# EAGLE design MAESTRAL (EAGLE 7.3.0)

## Sheet 1 of 8: PROCESSOR
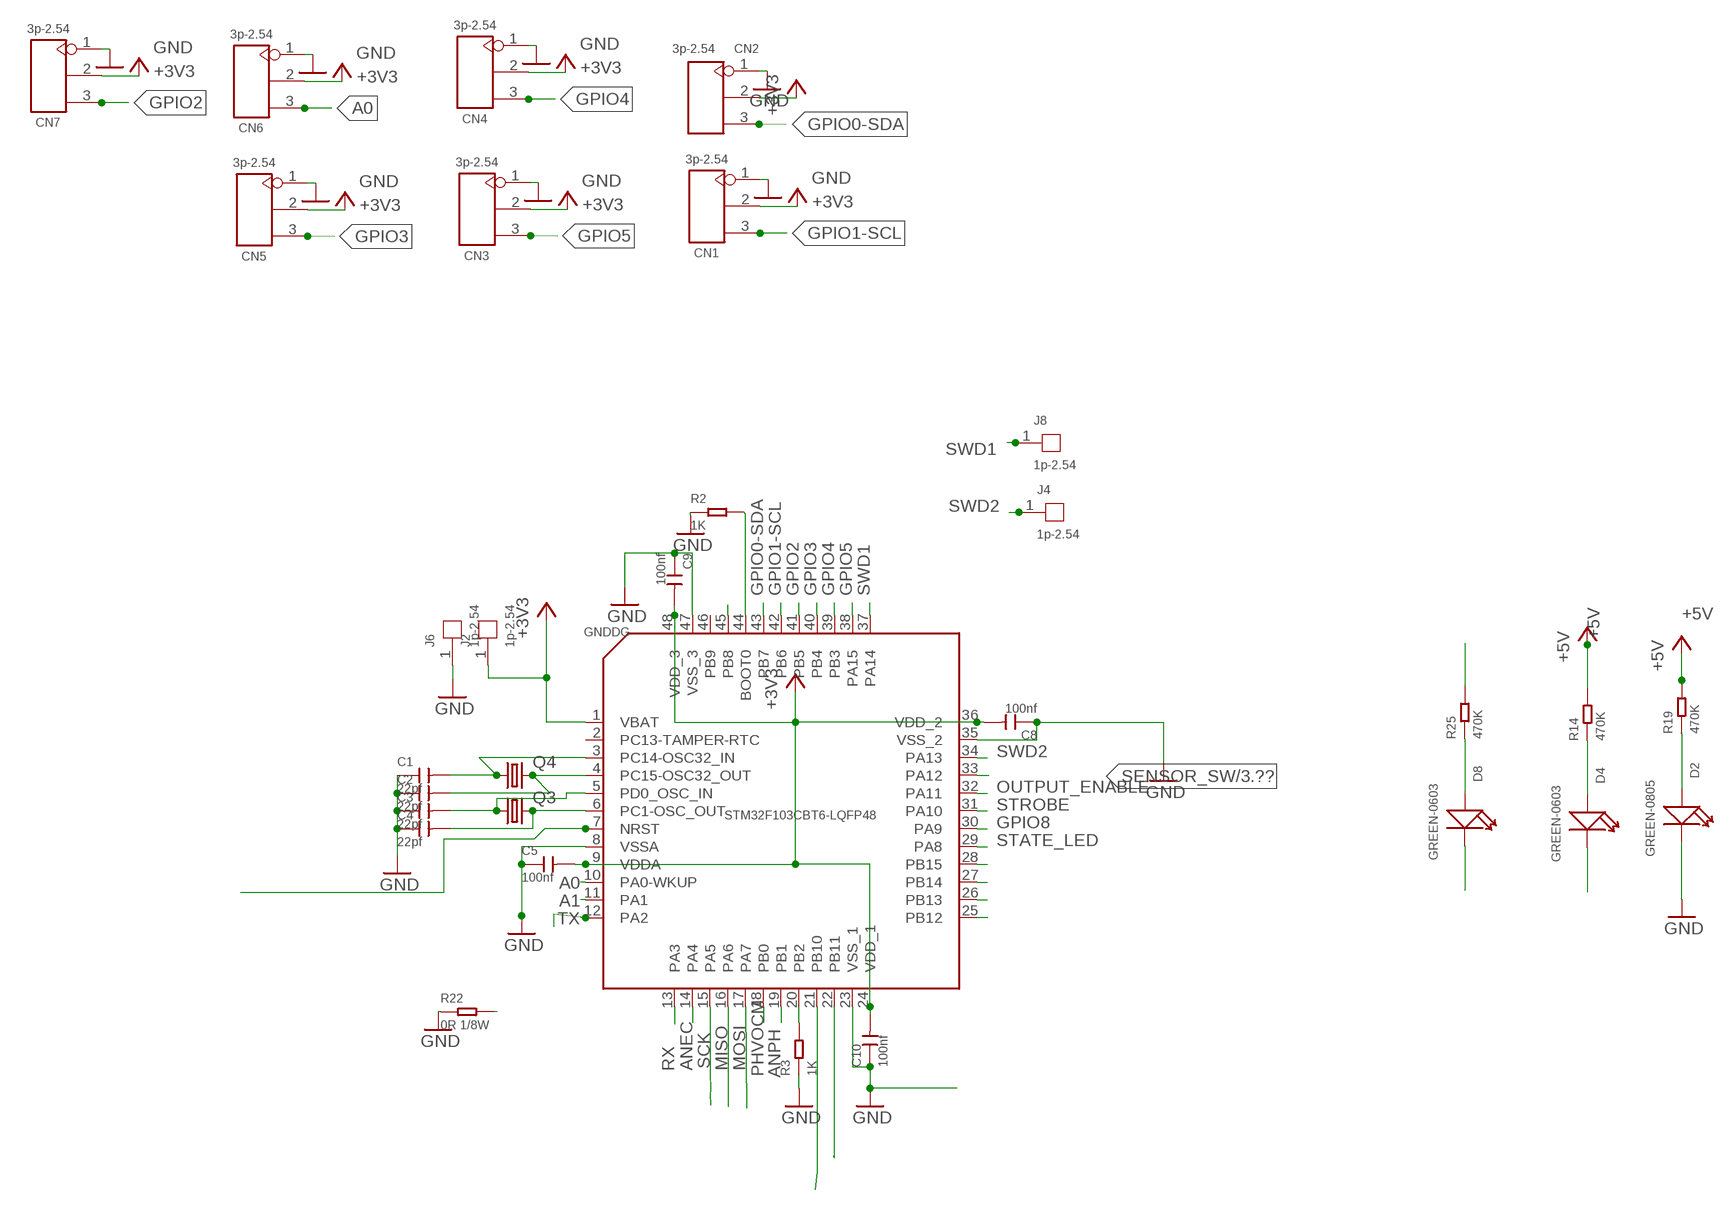
[diagram p0: schematic, sheet 1]

### Parts
C1  22pf  CERAMIC-22PF-50V-5%-NPO(0603)  [C0603]
C2  22pf  CERAMIC-22PF-50V-5%-NPO(0603)  [C0603]
C3  22pf  CERAMIC-22PF-50V-5%-NPO(0603)  [C0603]
C4  22pf  CERAMIC-22PF-50V-5%-NPO(0603)  [C0603]
C5  100nf  CERAMIC-100NF-50V-10%-X7R(0603)  [C0603]
C8  100nf  CERAMIC-100NF-50V-10%-X7R(0603)  [C0603]
C9  100nf  CERAMIC-100NF-50V-10%-X7R(0603)  [C0603]
C10  100nf  CERAMIC-100NF-50V-10%-X7R(0603)  [C0603]
CN1  3p-2.54  DIP-BLACK-MALE-HEADER-VERT(3P-2.54)  [H3-2.54]
CN2  3p-2.54  DIP-BLACK-MALE-HEADER-VERT(3P-2.54)  [H3-2.54]
CN3  3p-2.54  DIP-BLACK-MALE-HEADER-VERT(3P-2.54)  [H3-2.54]
CN4  3p-2.54  DIP-BLACK-MALE-HEADER-VERT(3P-2.54)  [H3-2.54]
CN5  3p-2.54  DIP-BLACK-MALE-HEADER-VERT(3P-2.54)  [H3-2.54]
CN6  3p-2.54  DIP-BLACK-MALE-HEADER-VERT(3P-2.54)  [H3-2.54]
CN7  3p-2.54  DIP-BLACK-MALE-HEADER-VERT(3P-2.54)  [H3-2.54]
D2  GREEN-0805  SMD-LED-CLEAR-GREEN(0805)  [LED-0805]
D4  GREEN-0603  SMD-LED-CLEAR-GREEN(0603)  [LED-0603]
D8  GREEN-0603  SMD-LED-CLEAR-GREEN(0603)  [LED-0603]
GNDDG  STM32F103CBT6-LQFP48  MCU-STM32F103CBT6(LQFP48)  [LQFP48-0.5-7X7MM]
J2  1p-2.54  DIP-BLACK-ROUND-FEMALE-HEADER-VERT(1P-2.54)  [1P-65/35MIL]
J4  1p-2.54  DIP-BLACK-ROUND-FEMALE-HEADER-VERT(1P-2.54)  [1P-65/35MIL]
J6  1p-2.54  DIP-BLACK-ROUND-FEMALE-HEADER-VERT(1P-2.54)  [1P-65/35MIL]
J8  1p-2.54  DIP-BLACK-ROUND-FEMALE-HEADER-VERT(1P-2.54)  [1P-65/35MIL]
Q3  CRYSTALSM49  [SM49]
Q4  CRYSTALMM20SS  [MM20SS]
R2  1K  SMD-RES-1K-1%-1/10W(0603)  [R0603]
R3  1K  SMD-RES-1K-1%-1/10W(0603)  [R0603]
R14  470K  SMD-RES-12K-1%-1/10W(0603)  [R0603]
R19  470K  SMD-RES-12K-1%-1/10W(0603)  [R0603]
R22  0R 1/8W  SMD-RES-0R-5%-1/8W(0805)  [R0805]
R25  470K  SMD-RES-12K-1%-1/10W(0603)  [R0603]

### Nets
+3V3: C5.2 C8.2 C9.2 C10.2 CN1.2 CN2.2 CN3.2 CN4.2 CN5.2 CN6.2 CN7.2 GNDDG.1(VBAT) GNDDG.9(VDDA) GNDDG.24(VDD_1) GNDDG.36(VDD_2) GNDDG.48(VDD_3) J2.1 ; also sheet 2,3,4,6,8
+5V: R14.2 R19.2 ; also sheet 3,5,7
A0: CN6.3 GNDDG.10(PA0-WKUP)
A1: GNDDG.11(PA1) ; also sheet 7
ANEC: GNDDG.14(PA4) ; also sheet 5
ANPH: GNDDG.19(PB1) ; also sheet 4
ECGND: D4.- ; also sheet 3,5
GND: CN1.1 CN2.1 CN3.1 CN4.1 CN5.1 CN6.1 CN7.1 D2.- R22.1 ; also sheet 3,6,7
GNDDG: C1.1 C2.1 C3.1 C4.1 C5.1 C8.1 C9.1 C10.1 D8.- GNDDG.8(VSSA) GNDDG.23(VSS_1) GNDDG.35(VSS_2) GNDDG.47(VSS_3) J6.1 R2.1 R3.1 R22.2 ; supply symbol labelled GND ; also sheet 4,6,8
GPIO0-SDA: CN2.3 GNDDG.43(PB7)
GPIO1-SCL: CN1.3 GNDDG.42(PB6)
GPIO2: CN7.3 GNDDG.41(PB5)
GPIO3: CN5.3 GNDDG.40(PB4)
GPIO4: CN4.3 GNDDG.39(PB3)
GPIO5: CN3.3 GNDDG.38(PA15)
GPIO8: GNDDG.30(PA9)
MISO: GNDDG.16(PA6) ; also sheet 2
MISO-SDO: GNDDG.27(PB14) ; also sheet 4
MOSI: GNDDG.17(PA7) ; also sheet 2
MOSI-SDI: GNDDG.28(PB15) ; also sheet 4
N$1: C2.2 GNDDG.4(PC15-OSC32_OUT) Q4.4
N$2: C1.2 GNDDG.3(PC14-OSC32_IN) Q4.1
N$3: C4.2 GNDDG.6(PC1-OSC_OUT) Q3.2
N$4: C3.2 GNDDG.5(PD0_OSC_IN) Q3.1
N$5: GNDDG.7(NRST) ; also sheet 6
N$8: GNDDG.20(PB2) R3.2
N$17: GNDDG.44(BOOT0) R2.2
N$19: D8.+ R25.1
N$37: GNDDG.45(PB8) R25.2
N$38: D4.+ R14.1
N$46: D2.+ R19.1
OUTPUT_ENABLE: GNDDG.32(PA11) ; also sheet 2
PHCS: GNDDG.25(PB12) ; also sheet 4
PHVOCM: GNDDG.18(PB0) ; also sheet 4
RX: GNDDG.13(PA3) ; also sheet 6
SCK: GNDDG.15(PA5) ; also sheet 2
SCL2: GNDDG.21(PB10) ; also sheet 8
SCLK: GNDDG.26(PB13) ; also sheet 4
SDA2: GNDDG.22(PB11) ; also sheet 8
SENSOR_SW: GNDDG.33(PA12) ; also sheet 3
STATE_LED: GNDDG.29(PA8)
STROBE: GNDDG.31(PA10) ; also sheet 2
SWD1: GNDDG.37(PA14) J8.1
SWD2: GNDDG.34(PA13) J4.1
TX: GNDDG.12(PA2) ; also sheet 6
Unconnected: GNDDG.2(PC13-TAMPER-RTC) GNDDG.46(PB9)

## Sheet 2 of 8: MIC5841
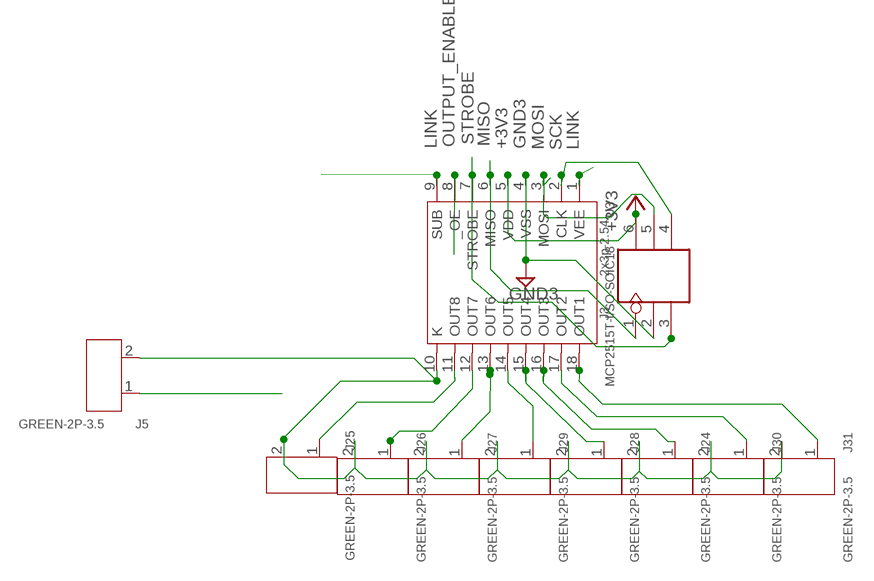
[diagram p1: schematic, sheet 2]

### Parts
J3  2x3p-2.54  DIP-BLACK-FEMALE-HEADER-VERT(2X3P-2.54)  [H2X3-2.54]
J5  GREEN-2P-3.5  SCREW-TERMINAL-GREEN(2P-3.5)  [H2-3.5-7.0X7.0MM]
J24  GREEN-2P-3.5  SCREW-TERMINAL-GREEN(2P-3.5)  [H2-3.5-7.0X7.0MM]
J25  GREEN-2P-3.5  SCREW-TERMINAL-GREEN(2P-3.5)  [H2-3.5-7.0X7.0MM]
J26  GREEN-2P-3.5  SCREW-TERMINAL-GREEN(2P-3.5)  [H2-3.5-7.0X7.0MM]
J27  GREEN-2P-3.5  SCREW-TERMINAL-GREEN(2P-3.5)  [H2-3.5-7.0X7.0MM]
J28  GREEN-2P-3.5  SCREW-TERMINAL-GREEN(2P-3.5)  [H2-3.5-7.0X7.0MM]
J29  GREEN-2P-3.5  SCREW-TERMINAL-GREEN(2P-3.5)  [H2-3.5-7.0X7.0MM]
J30  GREEN-2P-3.5  SCREW-TERMINAL-GREEN(2P-3.5)  [H2-3.5-7.0X7.0MM]
J31  GREEN-2P-3.5  SCREW-TERMINAL-GREEN(2P-3.5)  [H2-3.5-7.0X7.0MM]
U3  MCP2515T-I/SO-SOIC18  INTERFACE-MCP2515T-I/SO(SOIC18)  [SOIC18-1.27-11.5X7.5MM]

### Nets
+3V3: J3.6 U3.5(VDD) ; also sheet 1,3,4,6,8
GND3: J3.2 U3.4(VSS)
LINK: J5.1 U3.1(VEE) U3.9(SUB)
MISO: J3.1 U3.6(MISO) ; also sheet 1
MOSI: J3.5 U3.3(MOSI) ; also sheet 1
N$20: J26.1 U3.12(OUT7)
N$21: J27.1 U3.13(OUT6)
N$24: J5.2 J24.2 J25.2 J26.2 J27.2 J28.2 J29.2 J30.2 J31.2 U3.10(K)
N$26: J29.1 U3.14(OUT5)
N$27: J28.1 U3.15(OUT4)
N$28: J24.1 U3.16(OUT3)
N$45: J30.1 U3.17(OUT2)
N$68: J25.1 U3.11(OUT8)
OUT1: J31.1 U3.18(OUT1)
OUTPUT_ENABLE: U3.8(_OE) ; also sheet 1
SCK: J3.4 U3.2(CLK) ; also sheet 1
STROBE: J3.3 U3.7(STROBE) ; also sheet 1

## Sheet 3 of 8: POWER SUPPLY
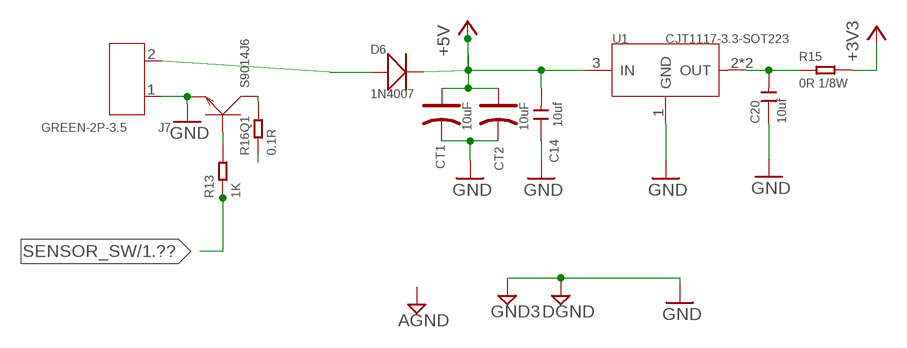
[diagram p2: schematic, sheet 3]

### Parts
C14  10uf  CERAMIC-10UF-25V-10%-X5R(0805)  [C0805]
C20  10uf  CERAMIC-10UF-25V-10%-X5R(0805)  [C0805]
CT1  10uF  ALUMINUM-SMD-220UF-16V(D6.3-H7.7MM)  [ELECTRO-SMD-C-6MM]
CT2  10uF  ALUMINUM-SMD-220UF-16V(D6.3-H7.7MM)  [ELECTRO-SMD-C-6MM]
D6  1N4007  DIODE-GEN-PURPOSE-1KV-1A(DO-214AC)  [DO-214AC]
J7  GREEN-2P-3.5  SCREW-TERMINAL-GREEN(2P-3.5)  [H2-3.5-7.0X7.0MM]
Q1  S9014J6  SMD-TRANSISTOR-NPN-50V-100MA-S9014J6(SOT-23)  [SOT-23]
R13  1K  SMD-RES-1K-1%-1/10W(0603)  [R0603]
R15  0R 1/8W  SMD-RES-0R-5%-1/8W(0805)  [R0805]
R16  0.1R  SMD-RES-0.1R-5%-1/8W(0805)  [R0805]
U1  CJT1117-3.3-SOT223  PMIC-CJT1117-3.3(SOT223)  [SOT-223]

### Nets
+3V3: R15.2 ; also sheet 1,2,4,6,8
+5V: C14.2 CT1.+ CT2.+ D6.2(-) U1.3(IN) ; also sheet 1,5,7
ECGND: R16.1 ; also sheet 1,5
GND: C14.1 C20.1 CT1.- CT2.- J7.1 Q1.2(E) U1.1(GND) ; also sheet 1,6,7
INTERRUMPIDO: Q1.3(C) R16.2
N$9: D6.1(+) J7.2
N$29: C20.2 R15.1 U1.2(OUT) U1.TER(OUT)
R: Q1.1(B) R13.2
SENSOR_SW: R13.1 ; also sheet 1

## Sheet 4 of 8: PH SENSOR
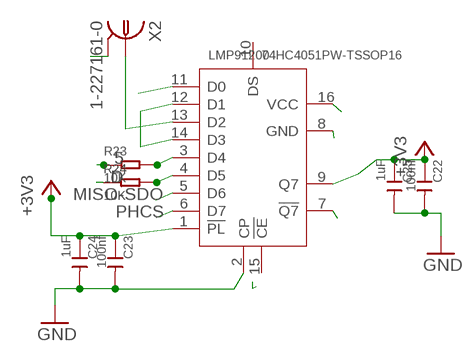
[diagram p3: schematic, sheet 4]

### Parts
C22  100nf  CERAMIC-100NF-50V-10%-X7R(0603)  [C0603]
C23  100nf  CERAMIC-100NF-50V-10%-X7R(0603)  [C0603]
C24  1uF  CERAMIC-100NF-50V-10%-X7R(0603)  [C0603]
C25  1uF  CERAMIC-100NF-50V-10%-X7R(0603)  [C0603]
LMP91200  74HC4051PW-TSSOP16  LOGIC-74HC4051PW(TSSOP16)  [TSSOP16-0.65-5X4.4MM]
R23  10K  SMD-RES-10K-1%-1/10W(0603)  [R0603]
R24  10K  SMD-RES-10K-1%-1/10W(0603)  [R0603]
X2  1-227161-0  [AMP_227161]

### Nets
5: LMP91200.3(D4) R23.2
+3V3: C22.1 C23.1 C24.1 C25.1 LMP91200.1(!PL) LMP91200.9(Q7) ; also sheet 1,2,3,6,8
ANPH: R24.1 ; also sheet 1
D: LMP91200.4(D5) R24.2
GNDDG: C22.2 C23.2 C24.2 C25.2 LMP91200.2(CP) ; supply symbol labelled GND ; also sheet 1,6,8
MISO-SDO: LMP91200.5(D6) ; also sheet 1
MOSI-SDI: LMP91200.8(GND) ; also sheet 1
N$41: LMP91200.11(D0)
N$42: LMP91200.12(D1) LMP91200.14(D3)
N$43: LMP91200.13(D2) X2.1
PHCS: LMP91200.6(D7) ; also sheet 1
PHVOCM: R23.1 ; also sheet 1
SCLK: LMP91200.7(!Q7) ; also sheet 1
VCM: LMP91200.16(VCC) X2.2
Unconnected: LMP91200.10(DS) LMP91200.15(!CE)

## Sheet 5 of 8: EC SENSOR
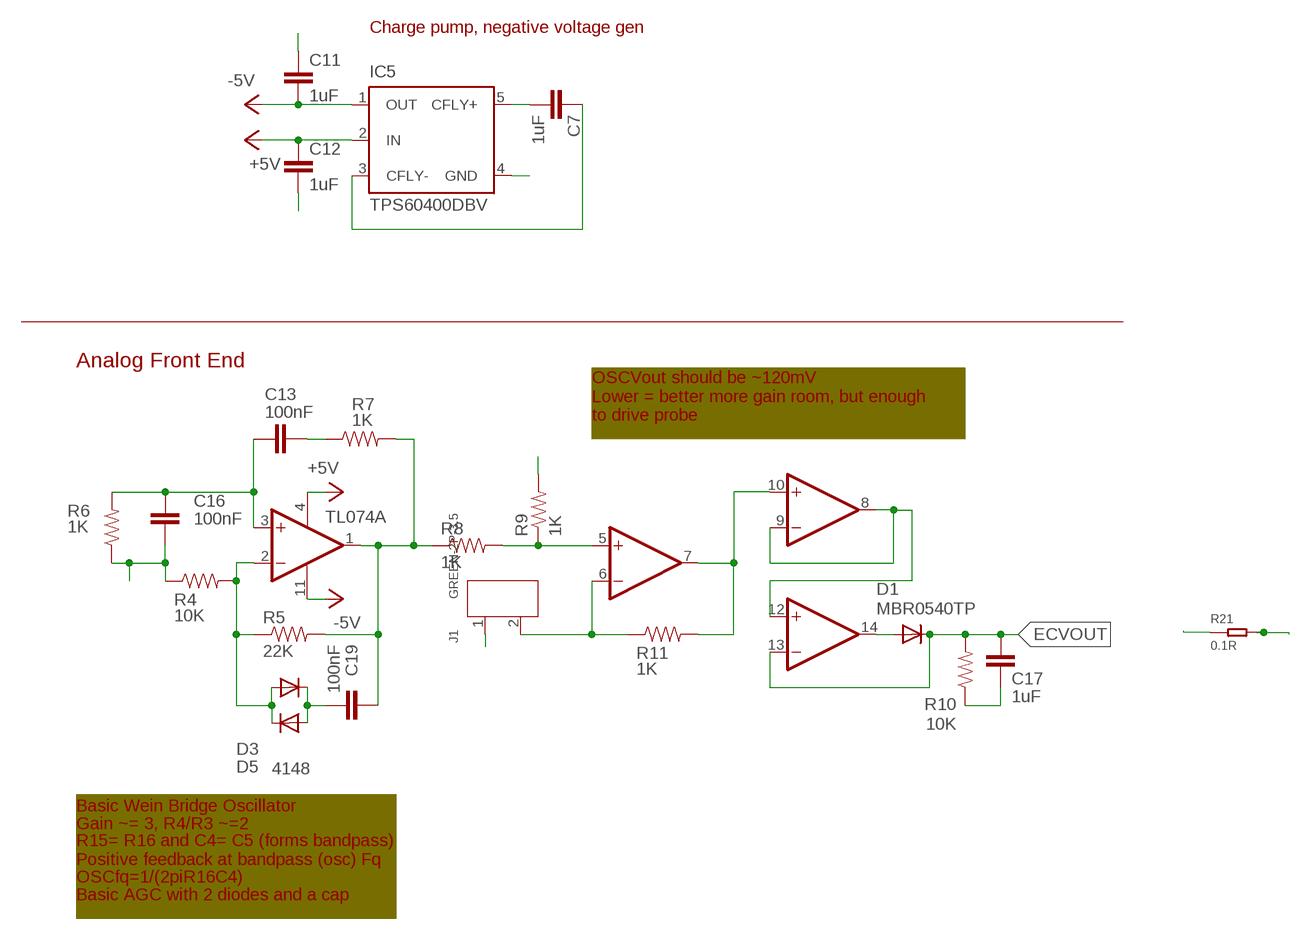
[diagram p4: schematic, sheet 5]

### Parts
C7  1uF  CAP0805  [0805]
C11  1uF  CAP0805  [0805]
C12  1uF  CAP0805  [0805]
C13  100nF  CAP0805  [0805]
C16  100nF  CAP0805  [0805]
C17  1uF  CAP0805  [0805]
C19  100nF  CAP0805  [0805]
D1  MBR0540TP  MBR0520LT  [SOD123]
D3  4148  MBR0520LT  [SOD123]
D5  4148  MBR0520LT  [SOD123]
IC5  TPS60400DBV  [SOT23-DBV]
J1  GREEN-2P-3.5  SCREW-TERMINAL-GREEN(2P-3.5)  [H2-3.5-7.0X7.0MM]
R4  10K  RESISTOR0805-RES  [0805]
R5  22K  RESISTOR0805-RES  [0805]
R6  1K  RESISTOR0805-RES  [0805]
R7  1K  RESISTOR0805-RES  [0805]
R8  1K  RESISTOR0805-RES  [0805]
R9  1K  RESISTOR0805-RES  [0805]
R10  10K  RESISTOR0805-RES  [0805]
R11  1K  RESISTOR0805-RES  [0805]
R21  0.1R  SMD-RES-0.1R-5%-1/8W(0805)  [R0805]
TL074  TL074  QUADOPAMPM  [SO14]

### Nets
+5V: C12.1 IC5.2(IN) TL074.4(P:V+) ; also sheet 1,3,7
-5V: C11.2 IC5.1(OUT) TL074.11(P:V-)
ANEC: R21.2 ; also sheet 1
ECGND: C11.1 C12.2 C16.1 C17.1 IC5.4(GND) J1.1 R4.1 R6.1 R9.2 R10.1 ; also sheet 1,3
ECVOUT: C17.2 D1.C R10.2 R21.1 TL074.13(D:-IN)
N$6: R11.2 TL074.7(B:OUT) TL074.10(C:+IN)
N$7: D1.A TL074.14(D:OUT)
N$18: C19.2 D3.C D5.A
N$22: C7.1 IC5.3(CFLY-)
N$23: C7.2 IC5.5(CFLY+)
N$30: C13.2 C16.2 R6.2 TL074.3(A:+IN)
N$31: D3.A D5.C R4.2 R5.1 TL074.2(A:-IN)
N$32: C13.1 R7.1
N$33: C19.1 R5.2 R7.2 R8.1 TL074.1(A:OUT)
N$34: R8.2 R9.1 TL074.5(B:+IN)
N$35: J1.2 R11.1 TL074.6(B:-IN)
N$39: TL074.8(C:OUT) TL074.9(C:-IN) TL074.12(D:+IN)

### Notes on the sheet
- Charge pump, negative voltage gen
- Analog Front End
- OSCVout should be ~120mV
  Lower = better more gain room, but enough
  to drive probe
- Basic Wein Bridge Oscillator
- Gain ~= 3, R4/R3 ~=2
- R15= R16 and C4= C5 (forms bandpass)
  Positive feedback at bandpass (osc) Fq
- OSCfq=1/(2piR16C4)
- Basic AGC with 2 diodes and a cap

## Sheet 6 of 8: ESP02 WIFI
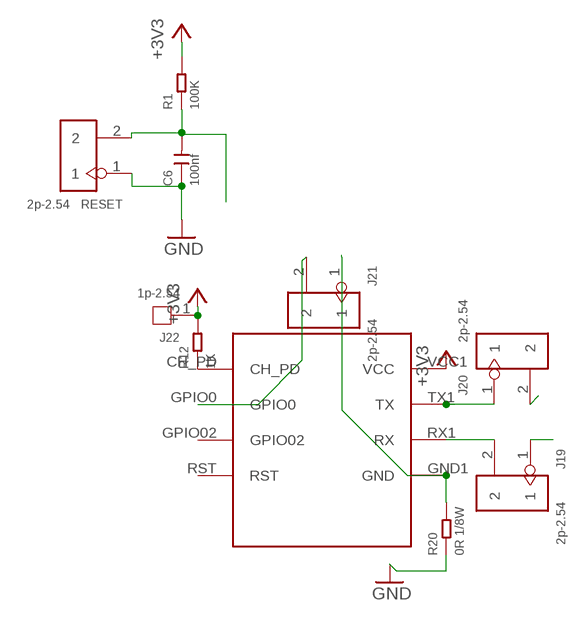
[diagram p5: schematic, sheet 6]

### Parts
C6  100nf  CERAMIC-100NF-50V-10%-X7R(0603)  [C0603]
J19  2p-2.54  DIP-BLACK-MALE-HEADER-VERT(2P-2.54)  [H2-2.54]
J20  2p-2.54  DIP-BLACK-MALE-HEADER-VERT(2P-2.54)  [H2-2.54]
J21  2p-2.54  DIP-BLACK-MALE-HEADER-VERT(2P-2.54)  [H2-2.54]
J22  1p-2.54  DIP-BLACK-ROUND-FEMALE-HEADER-VERT(1P-2.54)  [1P-65/35MIL]
R1  100K  SMD-RES-100K-1%-1/10W(0603)  [R0603]
R12  1K  SMD-RES-1K-1%-1/10W(0603)  [R0603]
R20  0R 1/8W  SMD-RES-0R-5%-1/8W(0805)  [R0805]
RESET  2p-2.54  DIP-BLACK-MALE-HEADER-VERT(2P-2.54)  [H2-2.54]
U$1  ESP-03  [ESP]

### Nets
+3V3: J22.1 R1.2 R12.2 U$1.VCC1(VCC) ; also sheet 1,2,3,4,8
GND: R20.1 ; also sheet 1,3,7
GNDDG: C6.1 RESET.1 ; supply symbol labelled GND ; also sheet 1,4,8
N$5: C6.2 R1.1 RESET.2 ; also sheet 1
N$25: R12.1 U$1.CH_PD
N$51: J21.1 R20.2 U$1.GND1(GND)
N$55: J20.1 U$1.TX1(TX)
N$56: J19.2 U$1.RX1(RX)
N$59: J21.2 U$1.GPIO0
RX: J19.1 ; also sheet 1
TX: J20.2 ; also sheet 1
Unconnected: U$1.GPIO02 U$1.RST

## Sheet 7 of 8: Amperimeter
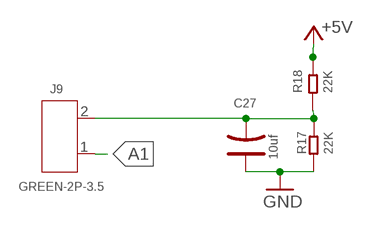
[diagram p6: schematic, sheet 7]

### Parts
C27  10uf  TANTALUM-SMD-10UF-10V-10%(AVX-A)  [AVX-A]
J9  GREEN-2P-3.5  SCREW-TERMINAL-GREEN(2P-3.5)  [H2-3.5-7.0X7.0MM]
R17  22K  SMD-RES-10K-1%-1/10W(0603)  [R0603]
R18  22K  SMD-RES-10K-1%-1/10W(0603)  [R0603]

### Nets
+5V: R18.2 ; also sheet 1,3,5
A1: J9.1 ; also sheet 1
GND: C27.+ R17.1 ; also sheet 1,3,6
N$72: C27.- J9.2 R17.2 R18.1

## Sheet 8 of 8: FRAM
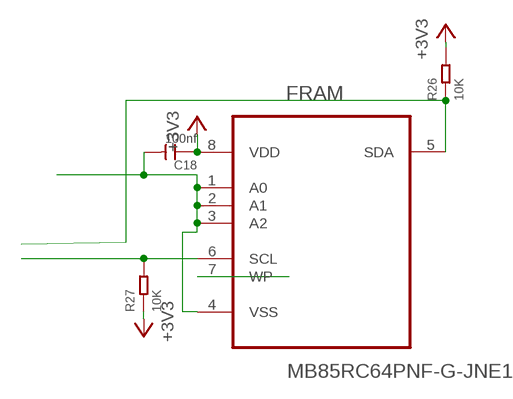
[diagram p7: schematic, sheet 8]

### Parts
C18  100nf  CERAMIC-100NF-50V-10%-X7R(0603)  [C0603]
FRAM  MB85RC64PNF-G-JNE1  [SOIC127P600X175-8N]
R26  10K  SMD-RES-10K-1%-1/10W(0603)  [R0603]
R27  10K  SMD-RES-10K-1%-1/10W(0603)  [R0603]

### Nets
+3V3: C18.1 FRAM.7(WP) FRAM.8(VDD) R26.2 R27.1 ; also sheet 1,2,3,4,6
GNDDG: C18.2 FRAM.1(A0) FRAM.2(A1) FRAM.3(A2) FRAM.4(VSS) ; also sheet 1,4,6
SCL2: FRAM.6(SCL) R27.2 ; also sheet 1
SDA2: FRAM.5(SDA) R26.1 ; also sheet 1

## Library data of the parts
C1-C4 = Seeed-OPL-Capacitor:CERAMIC-22PF-50V-5%-NPO(0603): 302010143
C5 C6 C8-C10 C18 C22 C23 = Seeed-OPL-Capacitor:CERAMIC-100NF-50V-10%-X7R(0603): 302010138; MPN: CC0603KRX7R9BB104
C7 C11-C13 C16 C17 C19 = SparkysWidgets:CAP: Capacitor Standard 0603 ceramic capacitor, and 0.1" leaded capacitor.
C14 C20 = Seeed-OPL-Capacitor:CERAMIC-10UF-25V-10%-X5R(0805): 302010178; MPN: CC0805KKX5R8BB106
C24 C25 = Seeed-OPL-Capacitor:CERAMIC-100NF-50V-10%-X7R(0603): 302010138; MPN: CC0603KRX7R9BB104; VALUE: 100nf
C27 = Seeed-Capacitor-2016:TANTALUM-SMD-10UF-10V-10%(AVX-A): 302020011; MPN: TAJA106K010RNJ
CN1-CN7 = Seeed-Connector -2016:DIP-BLACK-MALE-HEADER-VERT(3P-2.54): 320020079
CT1 CT2 = Seeed-OPL-Capacitor:ALUMINUM-SMD-220UF-16V(D6.3-H7.7MM): 302030053; MPN: CS1E221M-CRE77; VALUE: 220UF
D1 D3 D5 = SparkysWidgets:MBR0520LT: SCHOTTKY BARRIER RECTIFIER Source: http://onsemi.com .. MBR0520LT1-D.pdf
D2 = Seeed-OPL-Diode:SMD-LED-CLEAR-GREEN(0805): 304090057; MPN: 17-215SYGC/S530-E2/TR8
D4 D8 = Seeed-OPL-Diode:SMD-LED-CLEAR-GREEN(0603): 304090043; MPN: 19-217-G7C-AN1P2-3T
D6 = Seeed-Diode-2016:DIODE-GEN-PURPOSE-1KV-1A(DO-214AC): 304010013; MPN: 1N4007
FRAM = Fujitsu_By_element14_Batch_1:MB85RC64PNF-G-JNE1: Memory FRAM; MPN: MB85RC64PNF-G-JNE1; OC_FARNELL: 1831994; OC_NEWARK: 93R5162; PACKAGE: SO-8; SUPPLIER: FUJITSU
GNDDG = Seeed-OPL-ic:MCU-STM32F103CBT6(LQFP48): 310010004; MPN: STM32F103CBT6
IC5 = SparkysWidgets:TPS60400DBV: UNREGULATED CHARGE PUMP VOLTAGE INVERTER 60-mA unregultated charge pump voltage inverter Source: http://focus.ti.com/lit/ds/symlink/tps6040i.pdf
J1 J5 J7 J9 J24-J31 = Seeed-OPL-Connector:SCREW-TERMINAL-GREEN(2P-3.5): 320110028
J2 J4 J6 J8 J22 = Seeed-OPL-Connector:DIP-BLACK-ROUND-FEMALE-HEADER-VERT(1P-2.54): 320030026; MPN: RF130-1013BBS0741
J3 = Seeed-OPL-Connector:DIP-BLACK-FEMALE-HEADER-VERT(2X3P-2.54): 320030011; MPN: F185-1203A1BSYA1
J19-J21 RESET = Seeed-OPL-Connector:DIP-BLACK-MALE-HEADER-VERT(2P-2.54): 320020016; MPN: P125-1102A0BS116A1
LMP91200 = Seeed-OPL-ic:LOGIC-74HC4051PW(TSSOP16): 310070017; MPN: 74HC4051PW
Q1 = Seeed-OPL-Transistor:SMD-TRANSISTOR-NPN-50V-100MA-S9014J6(SOT-23): 305010022; MPN: S9014J6
Q3 Q4 = crystal:CRYSTAL: CRYSTAL; OC_FARNELL: unknown; OC_NEWARK: unknown
R1 = Seeed-OPL-Resistor:SMD-RES-100K-1%-1/10W(0603): 301010196; MPN: RC0603FR-07100KL
R2 R3 R12 R13 = Seeed-OPL-Resistor:SMD-RES-1K-1%-1/10W(0603): 301010298; MPN: RC0603FR-071KL
R4-R11 = SparkysWidgets:RESISTOR: Resistor Basic schematic elements and footprints for 0603, 1206, and PTH resistors.
R14 R19 R25 = Seeed-OPL-Resistor:SMD-RES-12K-1%-1/10W(0603): 301010102; MPN: RC0603FR-0712KL; VALUE: 12K
R15 R20 R22 = Seeed-OPL-Resistor:SMD-RES-0R-5%-1/8W(0805): 301010359; MPN: RC0805JR-070RL
R16 R21 = Seeed-OPL-Resistor:SMD-RES-0.1R-5%-1/8W(0805): 301010264; MPN: RL0805JR-070R1L
R17 R18 = Seeed-Resistor-2016:SMD-RES-10K-1%-1/10W(0603): 301010299; MPN: RC0603FR-0710KL; VALUE: 10K
R23 R24 = Seeed-Resistor-2016:SMD-RES-10K-1%-1/10W(0603): 301010299; MPN: RC0603FR-0710KL
R26 R27 = Seeed-OPL-Resistor:SMD-RES-10K-1%-1/10W(0603): 301010299; MPN: RC0603FR-0710KL
TL074 = SW_DigitalAnalogICs:QUADOPAMP: Quad General Purpose, Low Voltage, Rail-to-Rail Output Operational Amplifiers Source: http://www.national.com/mpf/LM/LMV321.html http://www.national.com/dt/lmv_qual.pdf
U1 = Seeed-OPL-ic:PMIC-CJT1117-3.3(SOT223): 310030097; MPN: CJT1117-3.3
U3 = Seeed-OPL-ic:INTERFACE-MCP2515T-I/SO(SOIC18): 310070025; MPN: MCP2515T-I/SO
U$1 = esp-03:ESP-03
X2 = con-coax:?227161*: JACK, RIGHT ANGLE, 50 OHM, PCB, BNC Source: amp_227161.pdf; MF: TYCO ELECTRONICS; MPN: 1-227161; OC_FARNELL: unknown; OC_NEWARK: 33B3200

## Board
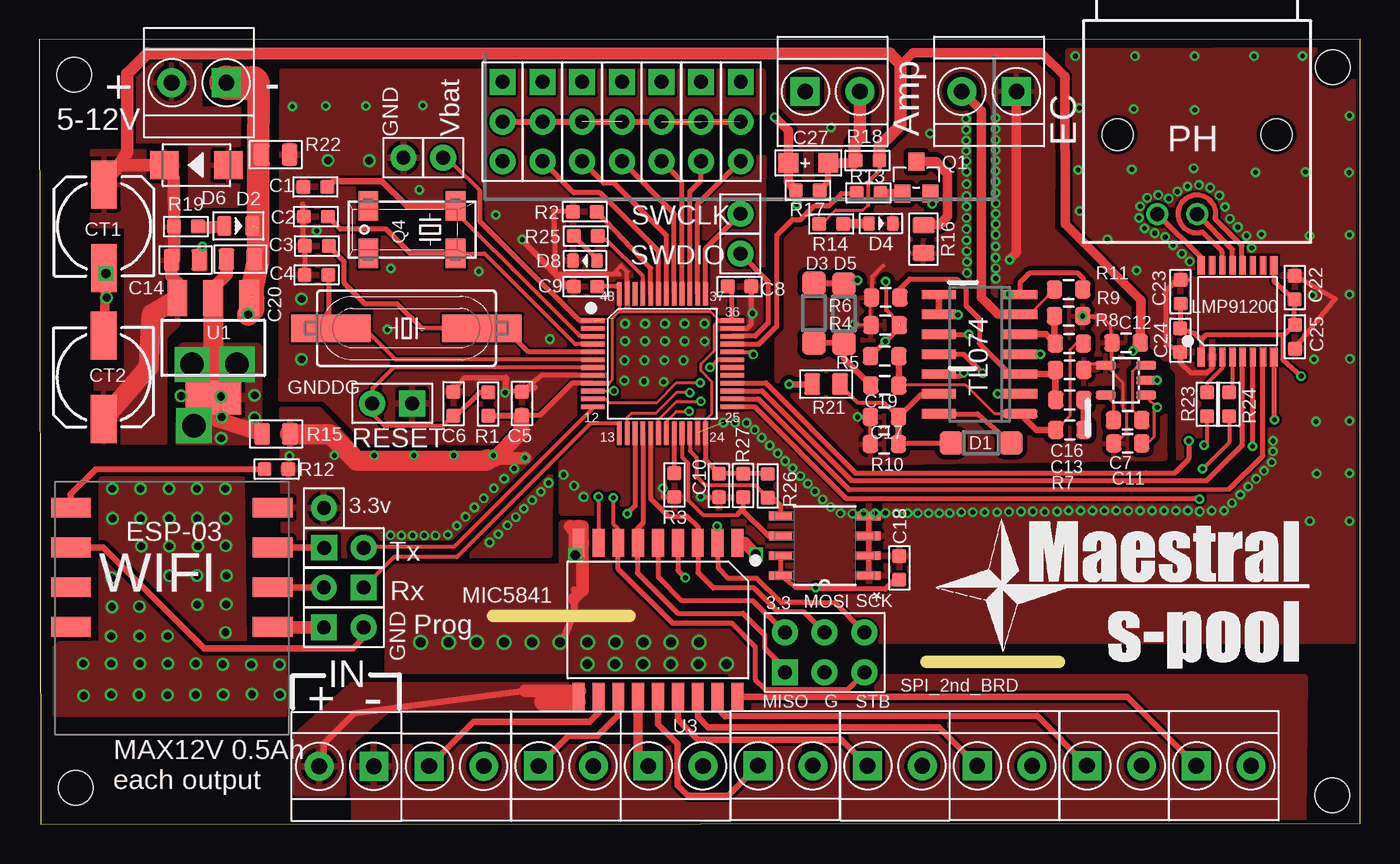
[diagram p8: board, top side]
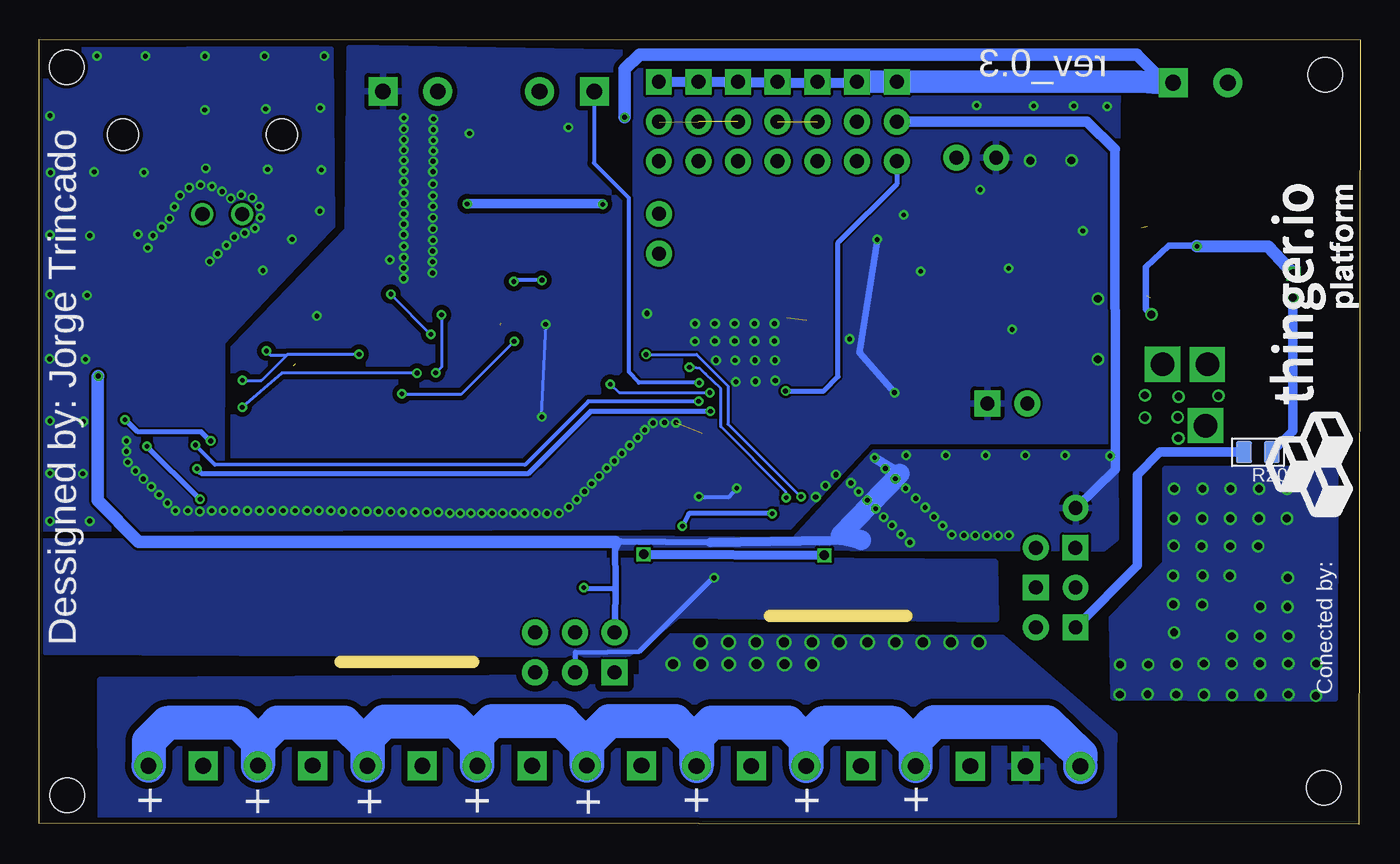
[diagram p9: board, bottom side, seen from below]

Size 84.44 x 50.2 mm. Coordinates in mm from the lower left corner, seen from the top.
Outline: 0.1,0 84.42,0.07 84.44,50.2 0,50.16 0.1,0
Copper layers (1*16): Top 0.035mm / dielectric 1.5mm / Bottom 0.035mm
Design rules "SeeedStudio_2layer_DRU_no_angle_20140221": minimum track width 6mil, minimum drill 12mil, track to track 6mil, track to pad 6mil, pad to pad 6mil, via to via 6mil, smd to smd 0mil, copper to edge 10mil, drill to drill 10mil, minimum pad ring 10mil, minimum via ring 6mil, stop-mask expansion 2mil, vias tented up to drill 100mil, thermal gap 10mil
Holes 2.2 mm at 82.68,48.4 82.64,1.88 2.26,47.93 2.34,2.33
Milling: 3 lines

### Footprints (pad centres in the part's own frame; a part is rotated, then mirrored left to right if it is on the bottom)
C0603 = smd 0.889 x 0.889: 1 0,0.762; 2 0,-0.762
0805 = smd 0.984 x 1.143: 1 -0.9,0; 2 0.9,0
C0805 = smd 1.397 x 1.016: 1 0,0.889; 2 0,-0.889
AVX-A = smd 1.27 x 1.27: + -1.27,0; - 1.27,0
H3-2.54 = drill 0.889 pad 1.651 square: 1 0,2.54 | drill 0.889 pad 1.651: 2 0,0; 3 0,-2.54
ELECTRO-SMD-C-6MM = smd 3.048 x 1.651: + 2.667,0; - -2.667,0
SOD123 = smd 1.524 x 1.524: A 1.9,0; C -1.9,0
LED-0805 = smd 0.889 x 1.27: + -0.889,0; - 0.889,0
LED-0603 = smd 0.762 x 0.889: + -0.762,0; - 0.762,0
DO-214AC = smd 1.8 x 1.77: 1 -2.042,0; 2 2.042,0
SOIC127P600X175-8N = smd 1.473 x 0.559: 1 -2.819,1.905; 2 -2.819,0.635; 3 -2.819,-0.635; 4 -2.819,-1.905; 5 2.819,-1.905; 6 2.819,-0.635; 7 2.819,0.635; 8 2.819,1.905
LQFP48-0.5-7X7MM = smd 1.5 x 0.3: 1 -4.45,2.75; 2 -4.45,2.25; 3 -4.45,1.75; 4 -4.45,1.25; 5 -4.45,0.75; 6 -4.45,0.25; 7 -4.45,-0.25; 8 -4.45,-0.75; 9 -4.45,-1.25; 10 -4.45,-1.75; 11 -4.45,-2.25; 12 -4.45,-2.75; 25 4.45,-2.75; 26 4.45,-2.25; 27 4.45,-1.75; 28 4.45,-1.25; 29 4.45,-0.75; 30 4.45,-0.25; 31 4.45,0.25; 32 4.45,0.75; 33 4.45,1.25; 34 4.45,1.75; 35 4.45,2.25; 36 4.45,2.75 | smd 0.3 x 1.5: 13 -2.75,-4.45; 14 -2.25,-4.45; 15 -1.75,-4.45; 16 -1.25,-4.45; 17 -0.75,-4.45; 18 -0.25,-4.45; 19 0.25,-4.45; 20 0.75,-4.45; 21 1.25,-4.45; 22 1.75,-4.45; 23 2.25,-4.45; 24 2.75,-4.45; 37 2.75,4.45; 38 2.25,4.45; 39 1.75,4.45; 40 1.25,4.45; 41 0.75,4.45; 42 0.25,4.45; 43 -0.25,4.45; 44 -0.75,4.45; 45 -1.25,4.45; 46 -1.75,4.45; 47 -2.25,4.45; 48 -2.75,4.45
SOT23-DBV = smd 0.55 x 1.27: 1 -0.95,-1.3; 2 0,-1.3; 3 0.95,-1.3; 4 0.95,1.3; 5 -0.95,1.3
H2-3.5-7.0X7.0MM = drill 1 pad 1.85 square: 1 -1.75,0 | drill 1 pad 1.85: 2 1.75,0
1P-65/35MIL = drill 0.889 pad 1.651: 1 0,0
H2X3-2.54 = drill 0.889 pad 1.651 square: 1 -1.27,2.54 | drill 0.889 pad 1.651: 2 -1.27,0; 3 -1.27,-2.54; 4 1.27,-2.54; 5 1.27,0; 6 1.27,2.54
H2-2.54 = drill 0.889 pad 1.651 square: 1 0,1.27 | drill 0.889 pad 1.651: 2 0,-1.27
TSSOP16-0.65-5X4.4MM = smd 0.5 x 1.2: 1 -2.325,-2.925; 8 2.325,-2.925; 9 2.325,2.925; 16 -2.325,2.925 | smd 0.4 x 1.2: 2 -1.625,-2.925; 3 -0.975,-2.925; 4 -0.325,-2.925; 5 0.325,-2.925; 6 0.975,-2.925; 7 1.625,-2.925; 10 1.625,2.925; 11 0.975,2.925; 12 0.325,2.925; 13 -0.325,2.925; 14 -0.975,2.925; 15 -1.625,2.925
SOT-23 = smd 1.016 x 1.143: 1 -0.889,-1.016; 2 0.889,-1.016; 3 0,1.016
SM49 = smd 5.08 x 1.778: 1 -4.826,0; 2 4.826,0
MM20SS = smd 1.27 x 1.88: 1 -2.794,-1.524; 2 2.794,-1.524; 3 2.794,1.524; 4 -2.794,1.524
R0603 = smd 0.889 x 0.889: 1 0,0.762; 2 0,-0.762
R0805 = smd 1.397 x 1.016: 1 0,0.889; 2 0,-0.889
SO14 = smd 0.6 x 2.2: 1 -3.81,-2.6; 2 -2.54,-2.6; 3 -1.27,-2.6; 4 0,-2.6; 5 1.27,-2.6; 6 2.54,-2.6; 7 3.81,-2.6; 8 3.81,2.6; 9 2.54,2.6; 10 1.27,2.6; 11 0,2.6; 12 -1.27,2.6; 13 -2.54,2.6; 14 -3.81,2.6
SOT-223 = smd 1.27 x 2.286: 1 -2.286,-3.175; 2 0,-3.175; 3 2.286,-3.175 | smd 3.556 x 2.159: TER 0,3.175
SOIC18-1.27-11.5X7.5MM = smd 0.762 x 1.778: 1 -5.08,-4.915; 2 -3.81,-4.915; 3 -2.54,-4.915; 4 -1.27,-4.915; 5 0,-4.915; 6 1.27,-4.915; 7 2.54,-4.915; 8 3.81,-4.915; 9 5.08,-4.915; 10 5.08,4.915; 11 3.81,4.915; 12 2.54,4.915; 13 1.27,4.915; 14 0,4.915; 15 -1.27,4.915; 16 -2.54,4.915; 17 -3.81,4.915; 18 -5.08,4.915
ESP = smd 1.27 x 2.54: CH_PD 5.588,6.604; GND1 -2.032,-6.288; GPIO0 3.048,6.604; GPIO02 0.508,6.604; RST -2.032,6.604; RX1 0.508,-6.288; TX1 3.048,-6.288; VCC1 5.588,-6.288
AMP_227161 = drill 0.9 pad 1.27: 1 0,-5.08; 2 -2.54,-5.08 | hole 2: -5.08,0; 5.08,0

### Placement (x,y rotation side)
C1  17.66,40.76 90 top
C2  17.69,38.86 90 top
C3  17.74,36.98 90 top
C4  17.73,35.13 90 top
C5  30.86,26.91 0 top
C6  26.48,26.9 0 top
C7  69.56,25.84 180 top
C8  44.76,34.39 270 top
C9  34.92,34.38 90 top
C10  43.45,21.67 180 top
C11  69.57,24.37 0 top
C12  69.47,30.79 180 top
C13  65.86,27.14 180 top
C14  9.36,36.08 270 top
C16  65.85,29.06 180 top
C17  54.02,26.05 0 top
C18  54.98,16.4 180 top
C19  54.05,28.07 180 top
C20  12.86,36.14 270 top
C22  80.24,34.32 180 top
C23  72.94,34.06 180 top
C24  72.93,30.96 0 top
C25  80.26,31.18 0 top
C27  49.16,42.29 0 top
CN1  34.7,44.93 0 top
CN2  32.16,44.93 0 top
CN3  44.84,44.93 0 top
CN4  42.3,44.93 0 top
CN5  39.78,44.93 0 top
CN6  29.62,44.93 0 top
CN7  37.24,44.93 0 top
CT1  4.15,38.24 90 top
CT2  4.12,28.58 270 top
D1  60.2,24.39 0 top
D2  12.74,38.26 0 top
D3  49.51,32.69 90 top
D4  53.8,38.41 0 top
D5  51.42,32.65 270 top
D6  10.06,42.15 180 top
D8  34.88,36.04 180 top
FRAM  50.2,17.82 180 top
GNDDG  39.83,29.46 0 top
IC5  69.46,28.4 90 top
J1  60.71,46.86 180 top
J2  25.82,42.62 0 top
J3  50.2,11 90 top
J4  44.81,36.5 0 top
J5  19.64,3.72 180 top
J6  23.28,42.62 0 top
J7  10.22,47.42 180 top
J8  44.81,39.04 0 top
J9  50.71,46.86 0 top
J19  19.47,15.14 270 top
J20  19.48,17.69 90 top
J21  19.47,12.61 90 top
J22  18.2,20.23 0 top
J24  61.7,3.75 0 top
J25  26.67,3.73 0 top
J26  33.67,3.74 0 top
J27  40.68,3.74 0 top
J28  54.69,3.75 0 top
J29  47.69,3.76 0 top
J30  68.71,3.76 0 top
J31  75.7,3.76 0 top
LMP91200  76.59,32.81 0 top
Q1  56.06,41.35 0 top
Q3  23.48,31.72 180 top
Q4  23.83,38.02 180 top
R1  28.7,26.88 0 top
R2  34.88,39.17 90 top
R3  40.6,21.7 180 top
R4  54.07,31.92 0 top
R5  54.04,29.94 0 top
R6  54.11,33.69 0 top
R7  65.87,25.22 180 top
R8  65.83,30.75 180 top
R9  65.79,32.5 0 top
R10  54.02,24.32 0 top
R11  65.8,34.2 0 top
R12  15.18,22.72 90 top
R13  53,40.38 90 top
R14  50.63,38.39 270 top
R15  15.14,24.96 90 top
R16  56.52,37.42 180 top
R17  49.13,40.53 90 top
R18  52.94,42.44 90 top
R19  9.39,38.22 270 top
R20  6.55,23.8 270 bottom
R21  50.3,28.15 270 top
R22  15.12,42.82 90 top
R23  74.63,26.87 180 top
R24  76.05,26.87 180 top
R25  34.93,37.61 90 top
R26  46.57,21.64 180 top
R27  44.99,21.67 0 top
RESET  22.56,26.92 270 top
TL074  60.11,30.06 90 top
U1  11.13,30.48 180 top
U3  39.55,13.08 180 top
U$1  8.63,14.66 90 top
X2  74,44.1 0 top

### Tracks (layer width: path | path; a pad name or v marks a point on that pad's centre or on a via)
5
  Top 0.254: LMP91200.3 75.61,29.17 74.63,28.19 R23.2
+3V3  (via drill 0.3)  (4 unrouted)
  Top 0.178: 36.4,28.21 36.42,28.21 36.64,28.43 36.64,32.36 37.07,32.79 | 37.07,32.79 42.89,32.79 43.47,32.21 43.17,31.95 43.15,31.93 43.15,30.3 42.29,29.44 42.29,29.01 43,28.3 43,26.28 42.58,25.86 GNDDG.24 | GNDDG.48 37.08,32.8 37.07,32.79
  Top 0.254: 36.37,28.21 36.4,28.21 | J2.1 26.4,42.29 28.17,40.52
  Top 0.305: C8.2 44.28,34.42 GNDDG.36 43.47,32.21 | GNDDG.48 37.08,34.41 36.96,34.41 36.86,34.41 C9.2 | GNDDG.1 34.54,32.21 30.86,35.85 28.17,38.54 28.17,40.52 | C5.2 31.98,26.16 31.98,26.14 34.06,28.21 GNDDG.9 36.37,28.21 | LMP91200.9 78.91,34.73 C22.1 80.13,31.74 C25.1 | C25.1 79.47,31.23 79.47,29.73 79.48,29.73 v80.66,28.66 | 74.26,30.99 74.59,31.32 79.58,31.32 C25.1 | 74.26,30.99 LMP91200.1 | 74.26,30.99 73.86,31.39 C24.1 72.94,31.4 C23.1 | U3.5 39.58,17.97 39.58,15.82 41.08,14.3 45.63,14.3 J3.6 | CN6.2 CN2.2 CN1.2 | GNDDG.24 42.58,23.3 C10.2 46.54,22.43 | R26.2 46.54,22.43 | 46.54,22.43 R27.1 | C18.1 54.67,15.64 54.08,15.06 49.71,15.06 v49.62,15.14 48.36,15.14 FRAM.8 FRAM.7
  Top 0.406: C5.2 R1.2 30.16,26.13 | CN6.2 44.79,44.9 CN3.2
  Top 0.61: 28.57,23.26 28.57,23.27 28.99,23.7
  Top 0.813: v31.04,23.44 28.65,23.34
  Top 1.016: 28.65,23.34 29.07,23.34 30.84,25.11 30.84,26.13 C5.2
  Top 1.27: 27.03,23.26 28.57,23.26 28.65,23.34 | 27.01,23.24 27.03,23.26 | R15.2 18.58,24.96 20.28,23.25 27.03,23.26
  Bottom 0.254: 47.29,18.11 47.56,17.52 47.63,18.08
  Bottom 0.305: v49.62,15.14 49.58,15.09 47.62,15.09
  Bottom 0.406: 47.29,18.11 41.54,18.03 | 47.63,18.08 47.62,15.09 47.61,14.65 J3.6
  Bottom 0.61: 41.54,18.03 31.91,18.18 | 29.43,22.44 v31.04,23.44 | 15.69,43.18 15.65,22.69 J22.1
  Bottom 0.686: CN6.2 17.47,44.93 15.69,43.18
  Bottom 0.813: 47.63,18.08 78.08,18.08 80.7,20.7 80.7,28.64 v80.66,28.66
  Bottom 1.27: 31.91,18.18 33.22,18.5 29.43,22.44
  other vias: 29.35,18.56 32.56,21.83 26.11,18.52 28.41,20.85 15.99,23.56 27.25,19.66 29.71,22.1 30.46,19.65 31.5,20.72 32.05,21.28 30.97,20.19 29.93,19.12 28.79,18.03 29.06,21.49 27.82,20.27 26.69,19.1 30.36,22.76 29.03,23.6 26.49,23.6 23.95,23.6 21.41,23.6 18.87,23.6 23.87,18.47 25.33,18.47 24.61,18.47 23.15,18.47 22.46,18.48
  pour Top (isolate 0.254): 15.61,22.44 15.67,17.48 17.91,17.22 32.62,17.22 32.66,23.42 36.33,28.06 34.14,28.05 30,23.5 30,23.5 29.61,23.12 20.13,23.12 20.32,23.89 17.89,26.53 15.5,26.49 15.6,25.54 15.55,24.09 15.56,24.09
  pour Bottom: 15.62,18.29 15.66,23.48 15.65,23.79 31.08,23.79 36.2,18.19 47.62,18.3 47.64,17.73 17.6,17.66 16.42,17.63
  pour Bottom: 15.62,18.29 15.66,23.48 15.65,23.79 31.08,23.79 36.2,18.19 47.62,18.3 47.64,17.7 17.6,17.66 16.42,17.63
  pour Bottom: 15.62,18.29 15.66,23.48 15.65,23.79 31.08,23.79 36.2,18.19 47.62,18.3 47.64,17.7 17.6,17.66 16.42,17.63
+5V  (via drill 0.3)
  Top 0.178: 63.62,30.08 63.6,30.06 TL074.4 v63.98,30.06 v63.99,30.05 | IC5.2 71.21,28.4 v71.44,28.39 | R14.2 50.02,38.39 50.9,39.27 52.64,39.27 52.97,39.6
  Top 0.254: v69.91,30.27 69.91,30.33 C12.1 | R18.2 53.7,41.8 52.97,41.07 52.97,39.6
  Top 0.61: 70.37,30.73 C12.1 | C12.1 70.37,31.13 | 55.05,48.53 55.84,49.35 64.01,49.35 65.54,47.82 65.57,38.38 70.4,33.53 C12.1
  Top 0.813: U1.3 8.84,34.64 8.44,35.05 8.44,36.05 C14.2 8.62,36.23 R19.2 8.6,41.31 D6.2 5.12,42.15 4.85,41.81 | 4.85,41.81 CT1.+ | R18.2 53.7,43.35 55.05,44.7 55.05,48.53 55.05,48.59 54.36,49.27 6.94,49.3 5.62,47.98 5.62,42.96 4.85,41.81
  Top 1.27: CT2.+ 7.02,29.25 7.21,32.64 U1.3
  Bottom 0.178: v63.99,30.05 68.57,30.05 68.6,30.02 | 68.6,30.02 70.23,28.39 v71.44,28.39 | v69.91,30.27 | v69.91,30.27 69.66,30.02 68.6,30.02
  pour Top: 3.66,43.05 8.85,43.05 8.85,32.46 8.85,31.92 8.03,31.11 8.03,24.41 3.66,24.41 3.66,28.75 5.59,28.75 5.59,38.25 3.41,38.25 3.41,43.05 3.64,43.05
-5V  (via drill 0.3)
  Top 0.178: IC5.1 70.79,27.26 v71.46,26.68 71.26,26.49 71.26,24.81 70.83,24.37 C11.2
  Top 0.305: TL074.11 59.08,30.06 v60.28,28.85
  Bottom 0.178: v60.28,28.85 68.95,28.85 v71.46,26.68
A0  (via drill 0.3)
  Top 0.178: GNDDG.10 36.9,27.72 v36.73,27.71
  Bottom 0.178: v36.73,27.71 36.58,27.71 36.58,27.72
  Bottom 0.305: 36.58,27.72 34.27,27.72 33.38,28.63 33.38,37.21 29.62,40.94 CN6.3
A1  (via drill 0.3)
  Top 0.178: GNDDG.11 36.19,27.21 36.43,26.97 39.48,26.97 40.75,28.24 v42.25,28.24
  Bottom 0.254: v42.25,28.24 46.11,28.24 46.74,28.93 46.74,40.05 48.98,42.29 48.95,42.31 J9.1
ANEC  (via drill 0.3)
  Top 0.178: 48.98,28.14 R21.2 | v41.59,27.61 40.72,27.61 39.4,26.28 37.85,26.28 37.57,26.01 37.57,25.02 GNDDG.14
  Top 0.406: v47.94,28.14 48.98,28.14
  Bottom 0.178: v47.94,28.14 47.38,27.61 v41.59,27.61
ANPH  (via drill 0.3)
  Top 0.178: GNDDG.19 40.08,25.77 40.72,26.41 v41.54,26.41
  Top 0.254: R24.1 76.05,24.43 v74.36,22.74
  Bottom 0.305: v74.36,22.74 74.07,22.45 53.17,22.45 52.65,22.95 49.21,26.41 v41.54,26.41
D
  Top 0.254: LMP91200.4 76.26,27.74 R24.2
ECGND  (via drill 0.3)  (1 unrouted)
  Top 0.178: 68.84,24.38 69.53,25.06 69.53,26.34 69.28,26.59 69.28,28.23 IC5.4 | v52.31,26.05 53.09,26.08 | C16.1 66.82,29.06 67.21,29.45 68.05,29.45 | v52.07,31.97 53.12,31.97 | 53.12,31.97 R4.1 | 53.12,31.97 53.12,33.61 R6.1 53.25,34.29 | 67.96,32.45 68.5,31.89 68.56,30.68 68.56,29.52 68.39,29.35 | R10.1 53.13,26.04 C17.1
  Top 0.254: 53.25,34.29 53.25,35.03 53.94,35.72
  Top 0.305: R9.2 66.77,32.5 67.96,32.45
  Top 0.61: J1.1 62.46,36.54 v62.02,36.1
  Bottom 0.178: v52.07,31.97 52.38,26.1 v52.31,26.05
  other vias: 66.69,32.5 56.94,44.17 50.61,44.55 59.23,45.11 59.24,44.41 59.24,43.73 59.25,43.06 59.26,42.4 59.27,41.73 61.13,41.09 61.13,40.37 61.14,39.69 61.14,39.03 61.14,38.38 61.14,37.71 61.13,36.96 61.13,36.24 61.14,35.56 61.14,34.9 59.27,37.34 59.29,35.96 59.29,35.25 59.28,36.65 61.13,45.17 61.13,44.45 61.13,43.77 61.13,43.11 61.13,42.45 61.13,41.79 59.27,38.06 59.27,38.79 59.27,39.52 59.27,40.19 59.27,40.94
  pour Bottom (isolate 0.305): 72.02,23.39 52.8,23.44 47.27,29.12 47.29,38.26 47.21,49.35 47.8,49.36 64.6,49.65 64.73,38.01 72.02,30.5 72.02,23.59
  pour Top (isolate 0.3): 47.15,37.3 47.13,28.01 52.22,23.1 69.21,23.37 71.97,23.4 71.94,24.36 72.04,28.67 69.62,30.77 69.68,33.01 65.72,37.09 64.78,38 64.84,48.57 47.31,48.67 47.14,43.2 47.19,37.44
ECVOUT
  Top 0.178: 55.09,24.39 R10.2 54.92,24.12
  Top 0.254: R21.1 51.76,27.51 52.3,26.97 54,26.97 C17.2
  Top 0.305: 55.09,24.39 D1.C | C17.2 56.35,27.48 57.47,27.48 TL074.13
  Top 0.406: 54.92,24.12 C17.2
GND  (via drill 0.3, 0.5, 0.6)  (2 unrouted)
  Top 0.254: 13.99,38.16 13.64,47.4
  Top 0.406: 13.64,46.86 J7.1 | C20.1 13.64,34.72 13.64,33.78 | C27.+ 48.04,42.29 | C14.1 10.25,36.77 v10.44,36.96
  Top 0.61: CT2.- v4.27,35.21 | v4.27,35.21 CT1.- | v13.35,32.6 13.34,33.28 13.69,33.63 | v4.27,35.21 4.27,33.71 v4.31,33.68 | 13.56,34.45 13.64,34.37 | 13.59,36.77 14,36.05 | R22.1 14.23,42.42 14,42.18 | Q1.2 v57.08,39.67 | v48.42,39.64 48.42,40.48 R17.1 47.89,41.02 C27.+ 47.89,44.34 v47.02,45.21
  Top 1.422: 13.64,47.4 13.64,47.39 14.03,47.39 14,42.18 14,36.05 13.64,34.37 13.64,33.78 13.69,33.63 13.69,32.94 v13.35,32.6
  Top 2.184: J7.1 13.64,47.4
  Bottom 0.254: v10.44,36.96 10.8,36.96 10.85,37
  Bottom 0.305: 32.24,47.39 34.63,47.39 CN1.1 CN7.1 CN5.1 CN4.1
  Bottom 0.406: 10.85,37 12.26,36.99 13.71,35.62 13.71,32.96 13.47,32.72
  Bottom 0.61: 13.47,32.72 v13.35,32.6 | v57.08,39.67 48.44,39.67 v48.42,39.64 | v4.31,33.68 4.31,25.15 R20.1
  Bottom 0.686: CN3.1 32.24,47.39 CN6.1
  Bottom 0.813: v10.44,36.96 5.9,36.95 v4.27,35.21 | v47.02,45.21 47.02,48.28 46.08,49.22 14.3,49.22 12.48,47.4 11.98,47.4 J7.1
  Bottom 1.422: CN2.1 CN6.1 14.08,47.47 13.19,47.42 J7.1
GND3  (via drill 0.3)
  Top 0.305: U3.4 40.82,16.25 v41.31,15.77
  Bottom 0.305: v41.31,15.77 41.38,15.77 46.08,11.07 50.17,11.01 50.2,9.78 J3.2
  pour Bottom: 43.62,13.38 23.31,13.1 23.36,16.78 41.33,16.91 48.37,16.86 48.37,17.55 48.35,18.35 77.46,18.1 84.11,18.08 84.04,11.02 46.87,10.85 45.53,11.78
GNDDG  (via drill 0.3, 0.33, 0.5)  (1 unrouted)
  Top 0.254: 37.58,34.73 37.58,35.34 37.19,35.73 37.19,35.71 36.65,35.17 | C10.1 42.31,20.91 v42.27,20.95 | v39.86,21.49 39.86,20.95 R3.1
  Top 0.305: GNDDG.47 37.58,34.73 | 37.09,35.17 36.65,35.17 32.98,35.15 32.87,39.21 R2.1 | GNDDG.8 32.14,28.72 C5.1 31.71,27.94 v29.78,27.61 | 29.83,28.53 27.13,28.53 C6.1 | 45.33,34.34 C8.1 45.52,31.97 45.26,31.71 GNDDG.35 | C25.2 82.84,33.59 C22.2 | 16.83,39.66 16.83,37.13 C3.1 16.98,35.14 C4.1 | 73.35,34.82 C23.2 72.73,34.82 72.02,34.11 72.02,30.78 C24.2 72.93,29.54 73.59,28.88 74.63,28.88 74.96,29.21 LMP91200.2 | FRAM.1 FRAM.2 FRAM.3 FRAM.4
  Top 0.406: C9.1 33.67,34.44 v30.88,37.39 | v29.78,27.61 29.83,28.53
  Bottom 0.254: v42.27,20.95 40.37,20.95 v39.86,21.49
  Bottom 0.406: v30.88,37.39 32.02,30.17 v29.78,27.61
  other vias: 22.49,35.56 24.31,40.58 22.26,31.64 18.46,42.44 17.74,37.95 16.77,33.6 16.77,29.74 21.09,42.44 73.53,35.99 28.1,35.36 32.64,31.03 37.45,32.01 38.72,32.01 39.99,32.01 41.26,32.01 42.53,32.01 37.45,30.89 37.42,29.67 38.72,30.89 39.99,30.89 41.26,30.89 42.53,30.89 38.69,29.67 39.96,29.67 41.18,29.67 38.67,28.33 37.4,28.38 45.21,25.66 45.73,25.22 46.18,24.74 46.69,24.23 47.2,23.72 47.68,23.24 48.17,22.78 48.65,22.27 49.13,21.79 49.59,21.28 50.07,20.77 50.58,20.29 51.21,19.88 58.93,19.96 59.67,19.96 60.43,19.96 61.22,19.96 61.98,19.99 62.74,20.01 63.51,20.01 64.27,19.99 67.32,20.06 71.13,20.06 74.94,20.06 76.77,21.08 78.29,22.6 75.72,20.06 76.23,20.54 77.27,21.59 77.78,22.09 78.77,23.15 73.41,20.06 72.65,20.06 71.89,20.06 70.36,20.06 69.6,20.06 68.84,20.06 68.08,20.06 66.55,20.06 65.79,20.06 65.06,20.01 44.47,25.69 43.74,25.69 58.2,19.91 56.84,19.9 56.16,19.9 57.53,19.9 55.5,19.9 54.81,19.9 45.6,32.67 39.91,28.3 74.17,20.01 78.86,23.85 73.03,36.49 72.47,37.02 71.97,37.55 71.3,37.8 70.65,38.11 70.29,38.78 70.37,39.51 70.82,40.07 71.52,40.23 72.19,40.01 72.75,40.46 73.39,40.79 74.12,40.88 74.84,40.71 75.43,40.21 75.79,39.48 76.1,38.73 66.22,49.12 77.16,37.64 77.5,36.85 70.03,49.12 73.84,49.12 77.65,49.12 80.74,49.13 83.74,45.31 83.72,41.67 83.74,37.69 83.74,33.88 83.77,29.76 83.74,25.8 83.74,19.4 83.74,22.45 66.49,39.21 66.4,41.85 66.48,45.8 68.28,37.41 70.13,35.41 76.6,38.19 81.2,19.4 78.85,24.52 78.12,37.72 81.64,22.42 81.6,25.76 81.48,29.73 81.37,33.82 69.96,45.73 73.85,45.68 73.79,41.95 69.83,41.88 77.74,41.68 80.93,41.72 81.2,37.63 33.51,22.36 34.8,20.94 34.18,21.65 16.19,45.9 18.31,45.94 20.88,45.94 24.53,45.97 29.19,38.97 51.99,19.88 52.7,19.89 53.42,19.9 54.09,19.91
  pour Bottom: 15.49,48.09 28.74,48.14 32.71,48.14 33.47,48.13 34.65,48.17 36.58,48.09 37.64,48.1 38.47,48.13 46.31,48.18 46.29,28.82 52.24,22.59 59.31,22.58 72.79,22.53 72.73,30.81 66,37.97 65.72,38.25 65.81,49.55 84.19,49.5 84.08,18.88 36.46,19.06 31.35,24.5 15.68,24.5
  pour Top: 15.55,48.14 30.37,48.13 39.73,48.13 46.25,48.12 46.25,45.56 30.84,45.54 30.84,42.57 46.3,42.62 46.17,31.39 46.19,30.48 46.17,28.49 46.54,25.97 50.36,22.21 72.88,22.57 72.82,28.88 69.56,32.24 69.66,34.39 66.52,37.79 66.05,38.12 65.68,38.35 65.79,49.44 84.43,49.49 84.31,48.26 83.98,11.71 44.47,11.73 44.42,19.42 44.44,19.95 33.41,19.95 33.38,24.38 31.74,24.38 20.92,24.52 18.21,27.24 15.48,27.19 15.51,29.89 15.53,43.96
GNDESP  (via drill 0.5)
  other vias: 2.85,8.23 6.38,8.28 10,8.29 8.2,8.27 4.68,21.46 6.47,21.46 8.29,21.46 10.09,21.46 11.9,21.46 8.31,19.56 10.11,19.56 11.92,19.56 4.7,19.56 6.49,19.56 8.34,15.89 10.09,15.91 8.32,17.79 6.53,17.79 10.14,17.79 10.11,14.06 6.4,13.93 4.65,13.91 6.42,12.04 8.21,12.04 4.6,12.04 4.64,15.77 6.43,10.29 8.22,10.29 2.81,10.29 4.61,10.29 10.01,10.29 4.6,8.3 11.76,8.3 15.38,8.31 13.6,8.33 11.73,10.23 15.35,10.22 13.56,10.22 11.93,17.82 11.97,15.9 11.95,14.08 11.91,12.27
  pour Bottom: 1.61,22.73 1.63,8.02 15.78,8.12 15.89,13.2 12.45,16.71 12.45,22.74 1.61,22.74
  pour Top (isolate 0.254): 3.99,22.05 3.99,21.15 3.99,11.61 3.92,11.54 1.32,11.54 1.09,11.31 1.09,7.46 1.08,7.04 15.72,7.06 15.66,7.25 15.66,11.26 15.75,11.36 13.05,11.36 13.06,11.37 12.95,22.19
GPIO0-SDA
  Top 0.305: GNDDG.43 39.58,36.64 35.85,40.38 34.17,40.38 CN2.3
GPIO1-SCL
  Top 0.305: GNDDG.42 40.08,37.64 36.73,40.99 36.1,40.99 CN1.3
GPIO2
  Top 0.305: GNDDG.41 40.58,39.05 CN7.3
GPIO3
  Top 0.305: GNDDG.40 41.08,41.09 CN5.3
GPIO4
  Top 0.305: GNDDG.39 41.58,40.46 42.3,41.17 CN4.3
GPIO5
  Top 0.305: GNDDG.38 42.08,39.66 CN3.3
INTERRUMPIDO
  Top 0.61: 56.32,42.23 Q1.3 57.33,42.36 57.33,42.34 58.06,41.62 58.06,38.85 57.55,38.35 56.56,38.35 R16.2
LINK  (via drill 0.6, 0.64)
  Top 0.457: 34.21,15.02 34.2,14.43 34.19,13.48 33.5,11.87 v33.28,11.65
  Top 0.813: U3.1 45.07,18 v45.8,17.27 | v34.25,17.21 34.25,18.67 33.92,19.06 34.74,19.06 34.74,14.97 34.2,14.43
  Bottom 0.61: v45.8,17.27 v34.25,17.21 34.21,17.31
  other vias: 24.39,11.65 26.17,11.65 27.95,11.65 29.72,11.65 31.5,11.65 35.06,11.65 36.84,11.65 38.61,11.65 40.39,11.65 42.17,11.65 35.03,10.25 36.81,10.25 38.59,10.25 40.37,10.25 42.14,10.25 43.92,10.25
  pour Top (isolate 0.2): 20.41,0.38 20.13,0.38 20.13,1.83 20.05,1.88 20.05,4.98 45.7,4.95 45.7,7.74 44.1,9.77 22.28,9.83 22.22,16.47 33.15,16.49 33.42,16.47 33.4,19.26 35.06,19.27 35.06,16.74 36.94,16.75 38.88,15.26 40.46,12.96 40.56,12.86 44.14,12.86 46.29,10.71 46.29,9.44 80.87,9.39 80.8,0.36
  pour Bottom (isolate 0.406): 15.75,0.55 80.52,0.5 80.55,9.24 49.42,9.41 45.89,9.44 45.89,10.45 45.69,10.6 44.05,12.04 23.3,11.92 22.88,11.92 15.73,5.77 15.74,4.77
MISO
  Top 0.305: GNDDG.16 38.58,19.27 38.23,18.92 38.23,16.93 | U3.6 38.23,16.93 | 38.23,16.93 38.23,16.07 40.83,13.5 44.99,13.5 46.37,12.12 46.37,11.27 47.66,9.99 J3.1
MISO-SDO
  Top 0.305: GNDDG.27 46.19,27.71 51.91,21.98 74.63,21.98 76.9,24.25 LMP91200.5
MOSI
  Top 0.305: GNDDG.17 39.08,20.84 40.21,19.71 41.43,19.71 42.09,19.05 U3.3 42.09,16.11 43.09,15.11 45.68,15.11 47.22,13.58 48.89,13.58 J3.5
MOSI-SDI  (via drill 0.3)
  Top 0.305: GNDDG.28 46.46,28.22 52.17,22.46 70.75,22.47 72.58,22.47 73.47,23.36 v73.47,24.52 | LMP91200.8 78.95,29.85 v78.95,25.87
  Bottom 0.305: v73.47,24.52 73.6,24.62 74.07,25.09 78.13,25.1 v78.95,25.87
N$1
  Top 0.254: GNDDG.4 34.26,30.71 28.47,36.5 Q4.4
  Top 0.305: Q4.4 23.73,36.5 22.18,38.04 19.27,38.04 C2.2
N$2
  Top 0.254: GNDDG.3 34.56,31.21 30.28,35.49 28,37.77 27.11,38.64 26.64,39.11 Q4.1
  Top 0.406: Q4.1 23.47,39.55 21.9,41.12 18.78,41.12 C1.2
N$3
  Top 0.254: GNDDG.6 22.79,29.71 20.78,31.72 Q3.2
  Top 0.305: C4.2 18.49,32.64 Q3.2
N$4
  Top 0.305: GNDDG.5 31.29,30.21 29.78,31.72 Q3.1 24.47,31.69 22.89,33.28 20.83,33.28 20.16,33.95 19.77,34.33 19.5,34.6 19.5,35.98 C3.2
N$5
  Top 0.254: GNDDG.7 22.64,29.21 21.3,27.87 21.3,26.93 RESET.2 21.3,26.91 21.3,26.23 22.07,25.47 25.79,25.47 26.44,26.11 C6.2
  Top 0.305: C6.2 26.66,26.13 28.16,27.63 28.16,27.64 R1.1
N$6  (via drill 0.3)
  Top 0.178: TL074.7 62.62,33.79 61.86,33.79 61.86,33.81 v61.96,33.9
  Top 0.305: TL074.10 v59.4,31.33 | TL074.7 62.7,34.66 63.32,35.27 66.34,35.27 66.73,34.88 66.73,34.24 R11.2
  Bottom 0.178: v61.96,33.9 61.96,33.88 v59.4,31.33
N$7
  Top 0.305: TL074.14 59.98,26.25 D1.A
N$8
  Top 0.305: R3.2 GNDDG.20
N$9
  pour Top: 7.27,48.66 10.27,48.66 10.27,45.77 12.76,45.77 12.66,39.54 9.68,39.54 9.68,43.68 5.72,43.68 5.72,47.24
N$17
  Top 0.305: GNDDG.44 39.08,35.58 R2.2
N$18
  Top 0.406: D3.C 51.1,30.77 D5.A 51.42,29.79 C19.2
N$19
  Top 0.305: D8.+ 35.64,36.14 R25.1
N$20
  Top 0.406: U3.12 37.01,6.98 35.69,5.66 33.84,5.66 J26.1
N$21
  Top 0.61: U3.13 38.28,4.38 J27.1
N$22
  Top 0.178: C7.1 70.49,25.85 69.85,26.49 69.85,28.97 70.23,29.35 IC5.3
N$23
  Top 0.178: C7.2 68.69,26.92 IC5.5
N$24
  Top 0.406: U3.10 34.29,7.84 | 32.29,7.84 34.58,8.53 | 31.07,8.53 20.13,7.1 18.19,5.17 18.19,4.01 J5.2
  Top 0.813: 34.58,8.53 31.07,8.53
  Top 1.27: 34.29,7.84 32.29,7.84
  Bottom 2.184: J25.2 28.42,5.07 | 28.42,5.07 28.42,5.35 27.25,6.55 20.06,6.55 17.88,4.46 17.91,3.68 J5.2 | 28.42,5.07 29.84,6.49 34.31,6.49 35.39,5.42 35.39,3.77 J26.2 35.42,5.36 36.57,6.51 41.45,6.51 42.4,5.56 42.4,3.76 J27.2 42.43,5.23 43.8,6.6 48,6.6 49.42,5.19 49.42,3.79 J29.2 49.44,5.07 50.98,6.6 55.49,6.6 56.45,5.63 56.45,3.77 J28.2 56.44,5.17 57.83,6.56 62.38,6.56 63.43,5.51 63.43,3.78 J24.2 63.45,5.03 64.94,6.51 69.19,6.51 70.45,5.26 J30.2 70.46,5.27 71.68,6.49 76.26,6.49 77.43,5.33 77.43,3.78 J31.2
  pour Top: 33.99,7.46 22.26,7.34 19.44,4.75 19.44,1.98 16.44,2 16.44,5.71 19.97,8.89 34.73,8.89 34.53,7.51
N$25
  Top 0.406: R12.1 3.6,22.7 2.03,21.12 U$1.CH_PD
N$26
  Top 0.406: U3.14 39.55,6.4 40.8,5.15 40.8,2.51 41.46,1.85 44.03,1.85 J29.1
N$27
  Top 0.406: U3.15 40.82,6.68 42.09,5.41 51.29,5.41 J28.1
N$28
  Top 0.406: U3.16 42.09,6.88 42.75,6.22 57.49,6.22 J24.1
N$29  (via drill 0.5, 1.5)
  Top 0.254: 11.38,25.9 U1.TER
  Top 0.61: 11.09,34.14 11.09,32.62 U1.2
  Top 0.813: C20.2 11.97,35.15 10.98,34.16 10.98,33.8 U1.2
  Top 1.016: R15.1 11.38,25.9
  Top 1.27: U1.2 U1.TER
  other vias: 11.64,24.69 11.62,27.35 11.68,26.04 13.77,26.01 9.08,27.39 9.9,25.5 13.77,27.44 9.78,29.4 12.64,29.42
  pour Top: 10.53,30.55 9.22,30.53 8.94,24.5 14.1,24.56 13.96,24.7 13.96,30.48 10.56,30.48 10.56,30.47
N$30
  Top 0.178: 64.96,29.05 C16.2 64.68,28.79
  Top 0.305: R6.2 55,34.23 55.64,34.87 58.66,34.86 59.24,34.25 59.24,33.17 60.08,32.31 60.08,30.75 62.03,28.81 62.69,28.81 TL074.3
  Top 0.406: TL074.3 64.95,28.79 C16.2 64.95,27.14 C13.2
N$31  (via drill 0.3)  (1 unrouted)
  Top 0.178: TL074.2 v61.26,27.52 v61.25,27.53
  Top 0.254: 54.96,31.76 54.96,32.06 54.15,32.87 54.15,34.66 v54.1,34.71
  Top 0.305: R5.1 v54.08,30.88 54.96,31.76
  Top 0.406: D3.A 51.05,34.57 D5.C 51.42,33.91 v52.3,34.79
  Bottom 0.178: v61.25,27.53 57.43,27.53 v54.08,30.88
  Bottom 0.254: v52.3,34.79 54.02,34.79 v54.1,34.71
N$32
  Top 0.178: C13.1
  Top 0.406: C13.1 R7.1
N$33
  Top 0.178: 54.94,28.08 C19.1 54.98,28.1 59.22,28.1 61.07,26.25 TL074.1 | R8.1 66.28,30.75 65.87,30.33 65.87,26.12 R7.2
  Top 0.406: R5.2 C19.1 | R7.2 63.74,25.22 TL074.1
N$34
  Top 0.178: 62.72,31.35 TL074.5
  Top 0.406: 62.72,31.35 64.33,31.35 R8.2 64.89,30.79 R9.1
N$35
  Top 0.178: TL074.6 63.3,32.6 R11.1
  Top 0.61: TL074.6 62.68,32.62 61.28,32.62 60.21,33.69 60.21,45.62 J1.2
N$37
  Top 0.254: 38.58,34.72 38.58,35.04 36.24,37.39 35.91,37.39 R25.2
  Top 0.305: GNDDG.45 38.58,34.72
N$38
  Top 0.61: D4.+ 51.41,38.41 R14.1
N$39  (via drill 0.3)
  Top 0.178: 57.62,28.68 TL074.12 | v59.1,28.88
  Top 0.305: TL074.9 58.76,32.6 v58.72,32.58 | 57.62,28.68 58.89,28.68 v59.1,28.88
  Top 0.406: TL074.8 TL074.9
  Bottom 0.178: v58.72,32.58 58.72,29.23 v59.1,28.88
N$42
  Top 0.305: LMP91200.12 76.89,35.74 76.86,37 75.15,38.71 arc303 74.34,37.87 75.61,36.61 LMP91200.14
N$43
  Top 0.305: LMP91200.13 76.26,36.76 X2.1
N$45
  Top 0.406: U3.17 43.36,7.41 43.82,6.9 63.78,6.93 J30.1
N$46
  Top 0.813: R19.1 10.86,38.16 D2.+
N$51
  Top 0.406: 14.92,12.6 U$1.GND1
  Top 0.813: J21.1 14.95,12.61 U$1.GND1
  Bottom 0.61: R20.2 12.8,23.8 14.26,22.35 14.26,16.55 J21.1
N$55
  Top 0.406: U$1.TX1 18.21,17.71 J20.1
N$56
  Top 0.406: U$1.RX1 18.2,15.17 J19.2
N$59
  Top 0.406: J21.2 20.74,11.95 20.05,11.26 10.55,11.26 4.09,17.73 2.05,17.73 U$1.GPIO0
N$68
  Top 0.406: U3.11 35.74,7.13 35.19,6.57 27.76,6.57 J25.1
N$72
  Top 0.406: C27.- 50.43,41.07 R17.2
  Top 0.61: C27.- 52.03,42.29
  Top 0.813: 52.03,42.29 R18.1 52.1,42.52 52.1,43.51 52.45,43.86 J9.2
OUT1
  Top 0.406: U3.18 69.54,8.17 J31.1
OUTPUT_ENABLE  (via drill 0.3)
  Top 0.254: GNDDG.32 45.48,30.21 v45.65,30.04 | v35.74,20.95 35.74,17.56 U3.8
  Bottom 0.178: v45.65,30.04 42.42,30.04 40.42,28.04 40.42,25.6 v35.74,20.95
PHCS  (via drill 0.3)
  Top 0.305: GNDDG.25 45.71,26.71 51.57,20.85 73.92,20.85 v74.15,20.8 | v77.55,24.18 77.55,29.88 LMP91200.6
  Bottom 0.305: v74.15,20.8 74.25,20.87 v77.55,24.18
PHVOCM  (via drill 0.3)
  Top 0.178: GNDDG.18 39.58,25.88 40.75,27.05 v42.3,27.05
  Top 0.254: R23.1 74.63,24.43 v74.45,24.25
  Bottom 0.254: v42.3,27.05 49.33,27.05 53.4,22.98 73.21,23.01 v74.45,24.25
R
  Top 0.61: Q1.1 53.81,40.33 R13.2
RX
  Top 0.254: J19.1 22.69,17.09 26.7,17.09 35.26,25.65 37.09,25.65 37.08,25.64 GNDDG.13
SCK  (via drill 0.3)
  Top 0.254: U3.2 43.34,17.49 43.34,17.5
  Top 0.305: GNDDG.15 38.08,20.37 v37.59,19.87 | v43.33,19.07 43.34,17.5 43.4,16.41 44.03,15.74 45.86,15.74 47.41,14.19 49.16,14.19 49.21,14.18 50.88,14.18 J3.4
  Bottom 0.305: v37.59,19.87 42.91,19.87 v43.33,19.07
SCL2
  Top 0.254: 41.1,24.99 41.1,23.49 41.47,23.12 41.47,20.74 42.41,19.8 44.62,19.8 44.63,19.81
  Top 0.305: FRAM.6 46.6,18.44 44.99,20.04 R27.2 44.99,20.17 44.8,19.98 | 44.8,19.98 | 44.8,19.98 44.63,19.81 | 41.1,24.99 GNDDG.21
SCLK
  Top 0.305: GNDDG.26 44.76,27.21 45.97,27.2 51.76,21.41 76.08,21.43 78.22,23.57 LMP91200.7
SDA2
  Top 0.254: GNDDG.22 41.58,23.89 42.02,23.45 42.02,22.23 42.57,21.69 45.76,21.69 R26.1
  Top 0.305: R26.1 46.89,20.88 47.39,20.38 47.39,19.73 FRAM.5
SENSOR_SW
  Top 0.305: GNDDG.33 46.01,30.71 47.15,31.85 47.15,37.69 48.14,38.68 48.7,38.68 48.7,38.69 49.56,39.55 50.48,39.55 51.27,40.33 R13.1
STROBE  (via drill 0.3)
  Top 0.178: 42.88,29.17 v42.87,29.23
  Top 0.254: GNDDG.31 43.43,29.71 v42.87,29.23 | v36.69,20.88 36.69,19.22 36.99,18.92 36.99,17.95 36.99,16.93
  Top 0.305: U3.7 37.01,17.93 | 37.01,17.93 37.01,16.33 40.47,12.87 44.25,12.87 45.76,11.37 45.76,9.28 46.41,8.63 51.68,8.63 52.74,9.69 J3.3 | 37.01,17.93 36.99,17.95
  Bottom 0.178: v36.69,20.88 36.71,21.26 40.87,25.43 40.87,27.86 41.84,28.8 42.21,29.15 v42.87,29.23
SWD1
  Top 0.305: GNDDG.37 42.58,36.81 J8.1
SWD2
  Top 0.305: GNDDG.34 45.75,31.21 46.59,32.05 46.59,34.72 J4.1
TX
  Top 0.254: GNDDG.12 35.38,26.61 26.52,17.75 20.8,17.75 J20.2
VCM
  Top 0.305: LMP91200.16 74.26,36.22 X2.2

### Text on the board
tNames: Amp | - | + | PH | 5-12V | GND | Vbat | EC | SWCLK | SWDIO | 3.3v | ESP-03 | Tx | Rx | WIFI | MIC5841 | GND | 3.3 | MOSI | SCK | Prog | IN | - | - | SPI_2nd_BRD | + | MISO | G | STB | MAX12V 0.5Ah / each output
bNames: rev_0.3 | Dessigned by: Jorge Trincado | Conected by: | + | + | + | + | + | + | + | +
tDocu: A0 A1 A2 | I2C | D0 D1 D2 D3 | UART | EC PROBE | PH PROBE | ESP-02